# EAGLE design ISO_CAN_Modul (EAGLE 9.6.2)
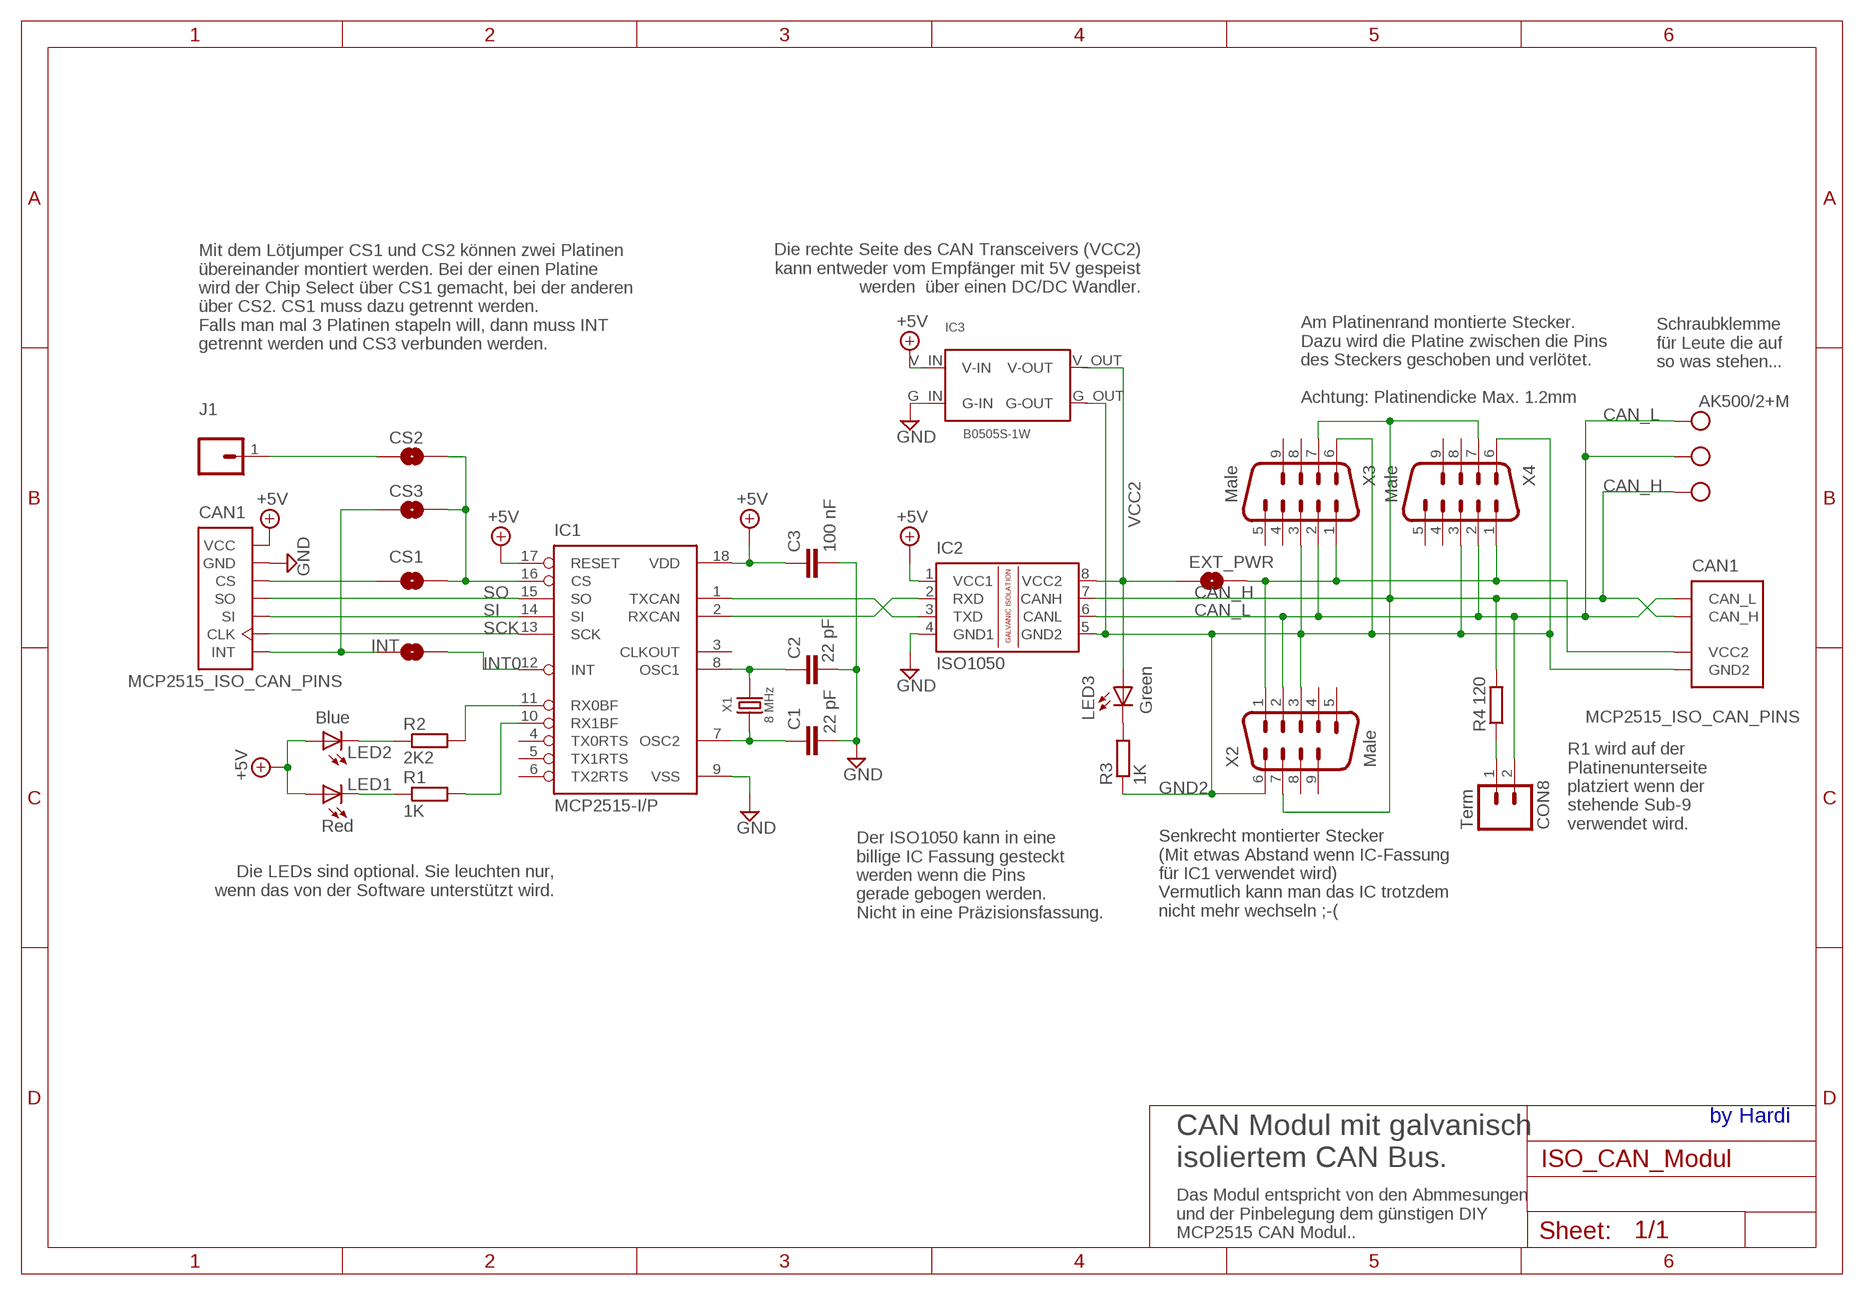
[diagram p0: schematic, sheet 1]

## Parts
C1  22 pF  C2.5/2  [C2.5-2]
C2  22 pF  C2.5/2  [C2.5-2]
C3  100 nF  C2.5/2  [C2.5-2]
CAN1  MCP2515_ISO_CAN_PINS  [MCP2515_ISO_CAN]
CON8  Term  M02PTH  [1X02]
CS1  SOLDERJUMPERTRACE  [SJ_2S-TRACE]
CS2  SOLDERJUMPERNO  [SJ_2S-NO]
CS3  SOLDERJUMPERNO  [SJ_2S-NO]
EXT_PWR  SOLDERJUMPERNO  [SJ_2S-NO]
IC1  MCP2515-I/P  [DIL18]
IC2  ISO1050  [DIL08]
IC3  B0505S-1W  DCDC  [DCDC-TEA_NME]
INT  SOLDERJUMPERTRACE  [SJ_2S-TRACE]
J1  M01  [1X01]
LED1  Red  LEDCHIPLED_0805  [CHIPLED_0805]
LED2  Blue  LEDCHIPLED_0805  [CHIPLED_0805]
LED3  Green  LEDCHIPLED_0805  [CHIPLED_0805]
R1  1K  R-EU_M0805  [M0805]
R2  2K2  R-EU_M0805  [M0805]
R3  1K  R-EU_M0805  [M0805]
R4  120  R-EU_0204/7  [0204/7]
X1  8 MHz  CRYSTAL-HC49U-V  [HC49U-V]
X2  Male  M09VB  [M09VB]
X3  Male  M09D  [M09D]
X4  Male  M09D  [M09D]
X5  AK500/2+M  [AK500/2+M]

## Nets
+5V: C3.1 CAN1.1(VCC) IC1.17(RESET) IC1.18(VDD) IC2.1(VCC1) IC3.V_IN(V-IN) LED1.A LED2.A
CAN_H: CAN1.9(CAN_H) IC2.7(CANH) R4.2 X2.7 X3.7 X4.7 X5.2
CAN_L: CAN1.8(CAN_L) CON8.2 IC2.6(CANL) X2.2 X3.2 X4.2 X5.1 X5.M
CS: CS1.2 CS2.2 CS3.2 IC1.16(CS)
CS_CAN0: CAN1.3(CS) CS1.1
CS_INT: CAN1.7(INT) CS3.1 INT.1
CS_J1: CS2.1 J1.1
GND: C1.2 C2.2 C3.2 CAN1.2(GND) IC1.9(VSS) IC2.4(GND1) IC3.G_IN(G-IN)
GND2: CAN1.11(GND2) IC2.5(GND2) IC3.G_OUT(G-OUT) R3.1 X2.3 X2.6 X3.3 X3.6 X4.3 X4.6
INT0: IC1.12(INT) INT.2
LED1: LED1.C R1.1
LED2: LED2.C R2.1
LED3: LED3.C R3.2
N$9: IC1.11(RX0BF) R2.2
N$30: IC1.10(RX1BF) R1.2
OSC1: C2.1 IC1.8(OSC1) X1.2
OSC2: C1.1 IC1.7(OSC2) X1.1
RXCAN: IC1.2(RXCAN) IC2.2(RXD)
SCK: CAN1.6(CLK) IC1.13(SCK)
SI: CAN1.5(SI) IC1.14(SI)
SO: CAN1.4(SO) IC1.15(SO)
TERM: CON8.1 R4.1
TXCAN: IC1.1(TXCAN) IC2.3(TXD)
VCC2: EXT_PWR.1 IC2.8(VCC2) IC3.V_OUT(V-OUT) LED3.A
VCC2_EXT: CAN1.10(VCC2) EXT_PWR.2 X2.1 X3.1 X4.1
Unconnected: IC1.3(CLKOUT) IC1.4(TX0RTS) IC1.5(TX1RTS) IC1.6(TX2RTS) X2.4 X2.5 X2.8 X2.9 X3.4 X3.5 X3.8 X3.9 X4.4 X4.5 X4.8 X4.9

## Notes on the sheet
- Die rechte Seite des CAN Transceivers (VCC2)
  kann entweder vom Empfänger mit 5V gespeist
  werden  über einen DC/DC Wandler.
- Mit dem Lötjumper CS1 und CS2 können zwei Platinen
  übereinander montiert werden. Bei der einen Platine
  wird der Chip Select über CS1 gemacht, bei der anderen 
  über CS2. CS1 muss dazu getrennt werden.
  Falls man mal 3 Platinen stapeln will, dann muss INT
  getrennt werden und CS3 verbunden werden.
- Schraubklemme
  für Leute die auf
  so was stehen...
- Am Platinenrand montierte Stecker.
  Dazu wird die Platine zwischen die Pins
  des Steckers geschoben und verlötet. 
  
  Achtung: Platinendicke Max. 1.2mm
- Senkrecht montierter Stecker
  (Mit etwas Abstand wenn IC-Fassung
  für IC1 verwendet wird)
  Vermutlich kann man das IC trotzdem
  nicht mehr wechseln ;-(
- R1 wird auf der
  Platinenunterseite
  platziert wenn der 
  stehende Sub-9
  verwendet wird.
- Die LEDs sind optional. Sie leuchten nur,
  wenn das von der Software unterstützt wird.
- Der ISO1050 kann in eine
  billige IC Fassung gesteckt
  werden wenn die Pins 
  gerade gebogen werden.
  Nicht in eine Präzisionsfassung.
- by Hardi
- CAN Modul mit galvanisch
  isoliertem CAN Bus.
- Das Modul entspricht von den Abmmesungen
  und der Pinbelegung dem günstigen DIY
  MCP2515 CAN Modul..

## Library data of the parts
C1-C3 = capacitor-wima:C: CAPACITOR naming: grid - package width
CAN1 = ISO_CAN_Modul:MCP2515_ISO_CAN_PINS: MCP2515 CAN Modul
CON8 = SparkFun-Connectors:M02: Standard 2-pin 0.1" header. Use with - straight break away headers ( PRT-00116) - right angle break away headers (PRT-00553) - swiss pins (PRT-00743) - machine pins (PRT-00117) - female headers (PRT-00115) Molex polarized connector foot print use with: PRT-08233 with associated crimp pins and housings. 2.54_SCREWTERM for use with PRT-10571. 3.5mm Screw Terminal footprints for PRT-08084 5mm Screw Terminal footprints for use with PRT-08432
CS1-CS3 EXT_PWR INT = SparkFun-Retired:SOLDERJUMPER: Solder Jumper Standard SMD solder jumper. Used to automate production. Two varients : Normally Open and Normally Closed are the same, but have different paste layers. NC will have a large amount of paste and should jumper during reflow.
IC1 = mcp2515:MCP2515
IC2 = texas:ISO1050: ISOLATED CAN TRANSCEIVER Source: http://focus.ti.com/lit/ds/symlink/iso1050.pdf Hardi: Added DIL08 Package
IC3 = MLL-Dominik-Hardi:DCDC
J1 = SparkFun-Connectors:M01: Standard 2-pin 0.1" header. Use with - straight break away headers ( PRT-00116) - right angle break away headers (PRT-00553) - swiss pins (PRT-00743) - machine pins (PRT-00117) - female headers (PRT-00115) Molex polarized connector foot print use with: PRT-08233 with associated crimp pins and housings. 2.54_SCREWTERM for use with PRT-10571. 3.5mm Screw Terminal footprints for PRT-08084 5mm Screw Terminal footprints for use with PRT-08432
LED1-LED3 = led:LED: LED OSRAM: - CHIPLED LG R971, LG N971, LY N971, LG Q971, LY Q971, LO R971, LY R971 LH N974, LH R974 LS Q976, LO Q976, LY Q976 LO Q996 - Hyper CHIPLED LW Q18S LB Q993, LB Q99A, LB R99A - SideLED LS A670, LO A670, LY A670, LG A670, LP A670 LB A673, LV A673, LT A673, LW A673 LH A674 LY A675 LS A676, LA A676, LO A676, LY A676, LW A676 LS A679, LY A679, LG A679 - Hyper Micro SIDELED® LS Y876, LA Y876, LO Y876, LY Y876 LT Y87S - SmartLED LW L88C, LW L88S LB L89C, LB L89S, LG L890 LS L89K, LO L89K, LY L89K LS L896, LA L896, LO L896, LY L896 - TOPLED LS T670, LO T670, LY T670, LG T670, LP T670 LSG T670, LSP T670, LSY T670, LOP T670, LYG T670 LG T671, LOG T671, LSG T671 LB T673, LV T673, LT T673, LW T673 LH T674 LS T676, LA T676, LO T676, LY T676, LB T676, LH T676, LSB T676, LW T676 LB T67C, LV T67C, LT T67C, LS T67K, LO T67K, LY T67K, LW E67C LS E67B, LA E67B, LO E67B, LY E67B, LB E67C, LV E67C, LT E67C LW T67C LS T679, LY T679, LG T679 LS T770, LO T770, LY T770, LG T770, LP T770 LB T773, LV T773, LT T773, LW T773 LH T774 LS E675, LA E675, LY E675, LS T675 LS T776, LA T776, LO T776, LY T776, LB T776 LHGB T686 LT T68C, LB T68C - Hyper Mini TOPLED® LB M676 - Mini TOPLED Santana® LG M470 LS M47K, LO M47K, LY M47K Source: http://www.osram.convergy.de LUXEON: - LUMILED® LXK2-PW12-R00, LXK2-PW12-S00, LXK2-PW14-U00, LXK2-PW14-V00 LXK2-PM12-R00, LXK2-PM12-S00, LXK2-PM14-U00 LXK2-PE12-Q00, LXK2-PE12-R00, LXK2-PE12-S00, LXK2-PE14-T00, LXK2-PE14-U00 LXK2-PB12-K00, LXK2-PB12-L00, LXK2-PB12-M00, LXK2-PB14-N00, LXK2-PB14-P00, LXK2-PB14-Q00 LXK2-PR12-L00, LXK2-PR12-M00, LXK2-PR14-Q00, LXK2-PR14-R00 LXK2-PD12-Q00, LXK2-PD12-R00, LXK2-PD12-S00 LXK2-PH12-R00, LXK2-PH12-S00 LXK2-PL12-P00, LXK2-PL12-Q00, LXK2-PL12-R00 Source: www.luxeon.com KINGBRIGHT: KA-3528ASYC Source: www.kingbright.com
R1-R4 = resistor:R-EU_: RESISTOR, European symbol
X1 = Discrete:CRYSTAL*: CRYSTAL
X2-X4 = con-subd:M09: SUB-D; OC_FARNELL: unknown; OC_NEWARK: unknown
X5 = Arduino_fuer_LEDs_DCC_2:AK500/2+M

## Board
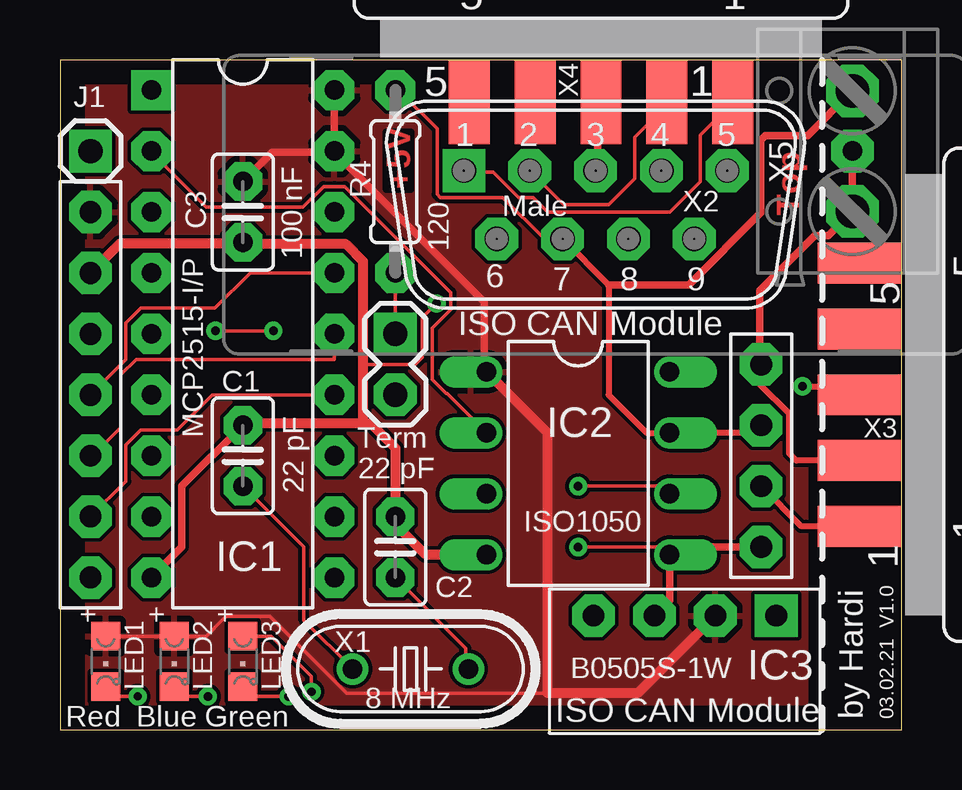
[diagram p1: board, top side]
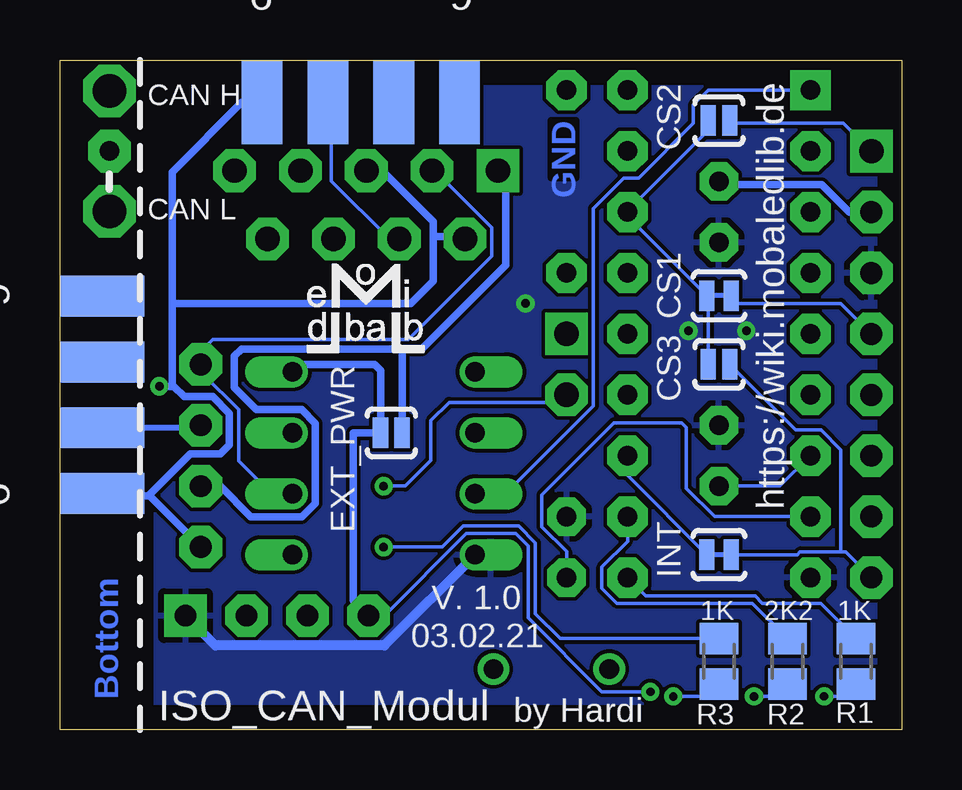
[diagram p2: board, bottom side, seen from below]

Size 35.08 x 27.93 mm. Coordinates in mm from the lower left corner, seen from the top.
Outline: 0,0 35.08,0 35.08,27.93 0,27.93 0,0
Copper layers (1*16): Top 0.035mm / dielectric 1.5mm / Bottom 0.035mm
Design rules "default *": minimum track width 6mil, minimum drill 0.35mm, track to track 6mil, track to pad 6mil, pad to pad 6mil, via to via 6mil, smd to smd 6mil, copper to edge 40mil, drill to drill 6mil, minimum pad ring 10mil, minimum via ring 8mil, stop-mask expansion 4mil, vias tented up to drill 0.5mm, thermal gap 10mil

### Footprints (pad centres in the part's own frame; a part is rotated, then mirrored left to right if it is on the bottom)
C2.5-2 = drill 0.813 pad 1.6 octagon: 1 -1.27,0; 2 1.27,0
MCP2515_ISO_CAN = drill 0.914 pad 1.778 octagon: 1 0,0; 2 0,-2.54; 3 0,-5.08; 4 0,-7.62; 5 0,-10.16; 6 0,-12.7; 7 0,-15.24; 8 27.94,-6.35; 9 27.94,-8.89; 10 27.94,-11.43; 11 27.94,-13.97
1X02 = drill 1.016 pad 1.778 square: 1 0,0 | drill 1.016 pad 1.778 octagon: 2 2.54,0
SJ_2S-TRACE = smd 0.635 x 1.27: 1 -0.508,0; 2 0.508,0
SJ_2S-NO = smd 0.635 x 1.27: 1 -0.45,0; 2 0.45,0
DIL18 = drill 0.813 pad 1.676 square: 1 -10.16,-3.81 | drill 0.813 pad 1.676 octagon: 2 -7.62,-3.81; 3 -5.08,-3.81; 4 -2.54,-3.81; 5 0,-3.81; 6 2.54,-3.81; 7 5.08,-3.81; 8 7.62,-3.81; 9 10.16,-3.81; 10 10.16,3.81; 11 7.62,3.81; 12 5.08,3.81; 13 2.54,3.81; 14 0,3.81; 15 -2.54,3.81; 16 -5.08,3.81; 17 -7.62,3.81; 18 -10.16,3.81
DIL08 = drill 0.813 pad 1.27 offset: 1 -3.81,-3.81; 2 -1.27,-3.81; 3 1.27,-3.81; 4 3.81,-3.81; 5 3.81,3.81; 6 1.27,3.81; 7 -1.27,3.81; 8 -3.81,3.81
DCDC-TEA_NME = drill 0.9 pad 1.778 square: G_IN 0,0 | drill 0.9 pad 1.778 octagon: G_OUT 5.08,0; V_IN 2.54,0; V_OUT 7.62,0
1X01 = drill 1.016 pad 1.778 square: 1 0,0
CHIPLED_0805 = smd 1.2 x 1.2: A 0,-1.05; C 0,1.05
M0805 = smd 1.3 x 1.6: 1 -0.95,0; 2 0.95,0
0204/7 = drill 0.813 pad 1.676 octagon: 1 -3.81,0; 2 3.81,0
HC49U-V = drill 0.813: 1 -2.413,0; 2 2.413,0
M09VB = drill 1.016 pad 1.778 square: 1 5.486,-1.422 | drill 1.016 pad 1.778 octagon: 2 2.743,-1.422; 3 0,-1.422; 4 -2.743,-1.422; 5 -5.486,-1.422; 6 4.115,1.422; 7 1.372,1.422; 8 -1.372,1.422; 9 -4.115,1.422
M09D = smd 1.7 x 3.5: 1 5.486,-6.045; 2 2.743,-6.045; 3 0,-6.045; 4 -2.743,-6.045; 5 -5.486,-6.045 | smd 1.7 x 3.5 bottom: 6 4.115,-6.045; 7 1.372,-6.045; 8 -1.372,-6.045; 9 -4.115,-6.045
AK500/2+M = drill 1.397 pad 2.184 octagon: 1 -2.515,0; 2 2.515,0 | drill 0.813 pad 1.778 octagon: M 0,0

### Placement (x,y rotation side)
C1  7.62,11.43 90 top
C2  13.97,7.62 90 top
C3  7.62,21.59 270 top
CAN1  1.27,21.59 0 top
CON8  13.97,16.51 270 top
CS1  7.62,18.1 180 bottom
CS2  7.62,25.4 180 bottom
CS3  7.62,15.24 180 bottom
EXT_PWR  21.27,12.38 0 bottom
IC1  7.62,16.51 270 top
IC2  21.59,11.11 270 top
IC3  29.84,4.76 180 top
INT  7.62,7.3 180 bottom
J1  1.27,24.13 0 top
LED1  1.91,2.86 180 top
LED2  4.76,2.86 180 top
LED3  7.62,2.86 180 top
R1  1.91,2.86 90 bottom
R2  4.76,2.86 90 bottom
R3  7.62,2.86 270 bottom
R4  13.97,22.86 90 top
X1  14.61,2.54 0 top
X2  22.31,21.89 180 top
X3  39.37,13.97 270 top
X4  22.54,32.21 0 top
X5  33.02,24.13 90 top

### Tracks (layer width: path | path; a pad name or v marks a point on that pad's centre or on a via)
+5V
  Top 0.152: 11.43,24.08 IC1.17 IC1.18 | LED1.A LED2.A 6.1,3.91 6.81,4.62 6.92,4.74 8.74,4.74 11.95,1.52 20.32,1.52
  Top 0.305: C3.1 8.84,24.08 11.43,24.08 | IC1.18 11.43,24.08 | IC2.1 17.68,15.02 17.68,17.83 11.43,24.08
  Top 0.406: IC3.V_IN 24.07,1.52 20.32,1.52 20.32,12.38 IC2.1
  Bottom 0.305: C3.1 7.49,22.73 3.34,22.73 2.19,21.59 CAN1.1
  pour Top: 0,27.94 31.11,27.94 31.11,0 0,0
CAN_H
  Top 0.152: X2.7 20.17,20.47 18.44,22.2 15.84,22.2 15.71,22.33 15.71,25.06 14.1,26.67 R4.2
  Top 0.254: X2.7 22.86,18.55 22.86,13.97 24.45,12.38 IC2.7 28.89,12.38 CAN1.9
  Top 0.305: X5.2 31.15,24.77 29.38,24.77 29.2,24.59 29.2,21.56 26.2,18.55 22.86,18.55
  Bottom 0.152: X4.7 23.77,25.91 23.77,22.88 21.37,20.47 X2.7
  Bottom 0.254: X3.7 29.31,12.6 CAN1.9
CAN_L  (via drill 0.35)
  Top 0.152: 29.16,15.19 29.11,15.24 CAN1.8 | X4.2 25.15,25.91 23.94,24.7 23.94,22.97 22.86,21.89 20.99,21.89 X2.2 | v21.59,10.16 25.08,10.16 IC2.6
  Top 0.254: X3.2 30.68,11.23 30.38,11.53 30.38,13.18 29.16,14.4 29.16,15.19
  Top 0.305: X5.M X5.1 32.02,20.61 31.45,20.61 29.16,18.32 29.16,15.19
  Bottom 0.152: X2.2 19.08,22.83 18.97,22.83 17.08,20.93 17.08,19.75 20.56,16.27 28.72,16.27 29.21,15.78 CAN1.8 29.11,15.24 29.11,14.83 27.64,13.35 27.64,11.21 26.26,9.84 IC2.6 | CON8.2 14.29,13.65 18.86,13.65 19.62,12.89 19.62,11.24 20.7,10.16 v21.59,10.16
CS
  Bottom 0.152: CS2.2 8.08,25.3 8.08,24.99 11.43,21.64 IC1.16 11.43,21.4 CS1.2 8.07,18.04 CS3.2
CS_CAN0
  Bottom 0.152: CS1.1 6.79,17.78 2.54,17.78 CAN1.3
CS_INT
  Bottom 0.152: CAN1.7 2.34,7.42 2.54,7.42 | 2.54,7.42 4.25,7.42 4.37,7.3 INT.1 | CS3.1 4.43,12.5 3.37,12.5 2.54,11.67 2.54,7.42
CS_J1
  Bottom 0.152: J1.1 2.44,25.3 7.16,25.3 CS2.1
GND  (via drill 0.35)
  Top 0.152: v15.68,17.78 15.09,17.18 15.09,15.53 14.8,15.24 12.62,15.24 | v6.48,16.64 v8.89,16.64
  Top 0.305: IC1.9 5.08,7.62 5.08,10.16 C1.2
  Top 0.406: CAN1.2 2.49,20.27 7.57,20.27 C3.2 7.7,20.24 11.92,20.24 12.62,19.54 12.62,15.24 12.62,12.85 12.7,12.78 | 12.7,12.78 7.7,12.78 C1.2 | IC2.4 15.24,7.3 13.97,8.57 C2.2 13.97,11.75 12.94,12.78 12.7,12.78
  Bottom 0.406: IC2.4 21.57,3.52 28.6,3.52 IC3.G_IN
  pour Bottom: 31.11,27.94 0,27.94 0,0 30.8,0 31.11,0
GND2  (via drill 0.35)
  Top 0.152: v21.59,7.62 25.08,7.62 IC2.5 | 22.4,24.54 22.4,25.91 X4.3 22.4,24.54
  Top 0.254: v30.94,14.33 32.97,14.33 33.17,14.12
  Top 0.305: IC3.G_OUT 25.4,5.4 IC2.5 25.72,7.62 CAN1.11 | 33.17,14.12 X3.3 | X2.3 22.4,23.41 22.4,24.54
  Bottom 0.152: 33.02,9.75 33.22,9.75 X3.6 | 31.39,9.75 29.26,7.62 CAN1.11 | v21.59,7.62 19.15,7.62 18.27,8.5 15.96,8.5 15.27,7.8 15.27,4.83 14.24,3.81 R3.1 | 26.67,24.99 26.67,25.91 X4.6 26.67,24.99
  Bottom 0.305: CAN1.11 31.34,9.75 31.39,9.75 | 31.39,9.75 33.02,9.75 | 30.33,14.33 29.9,13.89 28.72,13.89 28.02,13.19 28.02,11.89 28.4,11.51 29.64,11.51 31.39,9.75 | v30.94,14.33 30.33,14.33 | 30.33,14.33 30.4,14.4 30.4,17.78 | X2.6 18.3,20.57 19.54,20.57 | 19.54,20.57 19.54,18.7 20.46,17.78 30.4,17.78 | 19.54,20.57 19.54,21.2 21.65,23.32 X2.3 | X4.6 27.5,26.16 30.4,23.25 30.4,17.78
INT0
  Bottom 0.152: INT.2 11.43,10.6 IC1.12
LED1  (via drill 0.35)
  Top 0.152: v3.24,1.4 2.32,1.4 LED1.C
  Bottom 0.152: v3.24,1.4 2.42,1.4 R1.1
LED2  (via drill 0.35)
  Top 0.152: v6.16,1.39 5.18,1.39 LED2.C
  Bottom 0.152: R2.1 5.28,1.39 v6.16,1.39
LED3  (via drill 0.35)
  Top 0.152: v9.53,1.39 8.03,1.39 LED3.C
  Bottom 0.152: R3.2 8.13,1.39 v9.53,1.39
N$9
  Bottom 0.152: R2.2 6.24,5.28 11.87,5.28 12.5,5.91 12.5,6.79 11.43,7.86 IC1.11
N$30
  Bottom 0.152: R1.2 3.38,5.28 5.81,5.28 6.11,5.59 10.67,5.59 IC1.10
OSC1
  Top 0.152: X1.2 16.92,2.59 16.92,3.4 C2.1
  Bottom 0.152: C2.1 13.97,7.43 15,8.46 15,9.8 12,12.8 9.18,12.8 8.98,12.61 8.98,10.07 7.8,8.89 IC1.8
OSC2
  Top 0.152: X1.1 10.16,4.57 10.16,7.62 C1.1
  Bottom 0.152: C1.1 5.08,10.16 IC1.7
RXCAN
  Top 0.152: IC1.2 3.81,24.08 6.1,21.79 10.12,21.79 10.99,22.66 11.43,22.66 11.87,22.66 16.29,18.24 16.29,17.53 15.52,16.76 15.52,14.61 16.09,14.03 16.13,14.03 IC2.2
SCK
  Top 0.152: CAN1.6 2.74,10.36 2.74,11.87 3.37,12.5 4.88,12.5 6.35,13.97 IC1.13
SI
  Top 0.152: IC1.14 11.43,15.44 3.17,15.44 2.54,14.81 2.54,12.6 1.37,11.43 CAN1.5
SO
  Top 0.152: IC1.15 7.92,19.05 6.45,17.58 3.37,17.58 2.74,16.95 2.74,15.44 CAN1.4
TERM
  Top 0.152: CON8.1 R4.1
TXCAN
  Bottom 0.152: IC1.1 8.08,26.67 8.69,26.06 8.69,25.3 10.97,23.01 11.58,23.01 12.85,21.74 12.85,13.51 16.2,10.16 17.46,10.16 IC2.3
VCC2  (via drill 0.35)
  Top 0.152: LED3.A 8.79,3.91 10.48,2.22 v10.48,1.59
  Bottom 0.152: IC3.V_OUT 21.58,4.76 18.15,8.19 16.09,8.19 15.57,7.67 15.57,4.66 12.5,1.59 v10.48,1.59
  Bottom 0.305: IC3.V_OUT 22.86,5.4 22.86,12.38 EXT_PWR.1 21.72,14.99 21.97,15.24 25.08,15.24 IC2.8
VCC2_EXT
  Top 0.152: X2.1 16.9,23.25 18.06,23.25 19.11,22.2 19.71,22.2 20.32,21.59 25.41,21.59 26.68,22.86 26.67,22.87 26.67,24.8 X4.1
  Top 0.254: X3.1 30.89,8.48 CAN1.10
  Bottom 0.305: CAN1.10 28.4,10.16 27.12,8.88 25,8.88 24.43,9.44 24.43,12.78 25,13.35 26.89,13.35 27.81,14.27 27.81,15.58 27.5,15.89 20.89,15.89 | X2.1 16.51,23 16.51,19.38 20,15.89 20.89,15.89 | EXT_PWR.2 20.82,15.82 20.89,15.89

### Text on the board
Top: Top | +5V
Bottom: GND | Bottom
tPlace: CAN L | ISO CAN Module | + | + | + | V1.0 | ISO CAN Module | by Hardi
bPlace: https://wiki.mobaledlib.de | CAN H | CAN L | by Hardi | ISO_CAN_Modul
tNames: 5 | 1 | 5 | 1
Document: Platinendicke Max. 1.2mm